# EAGLE design relais platine (EAGLE 6.1)
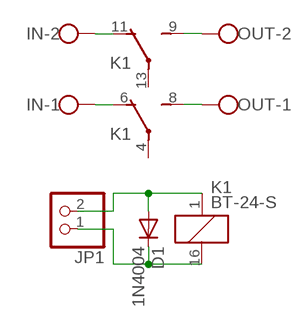
[diagram p0: schematic, sheet 1]

## Parts
D1  1N4004  [DO41-10]
IN  W237-102  [W237-102]
JP1  PINHD-1X2/90  [1X02/90]
K1  BT-24-S  [BT-XX-S]
OUT  W237-102  [W237-102]

## Nets
N$1: K1.8(-1:S) OUT.1
N$2: IN.2 K1.11(-2:O)
N$3: K1.9(-2:S) OUT.2
N$4: IN.1 K1.6(-1:O)
N$5: D1.A JP1.2 K1.1
N$6: D1.C JP1.1 K1.16
Unconnected: K1.4(-1:P) K1.13(-2:P)

## Library data of the parts
D1 = adafruit:1N4004: DIODE General purpose 1N400x type rectifier (With bigger pads) http://www.ladyada.net/library/pcb/eaglelibrary.html
IN OUT = con-wago-500:W237-102: WAGO SCREW CLAMP; MPN: 237-102; OC_FARNELL: unknown; OC_NEWARK: 70K9898
JP1 = pinhead:PINHD-1X2: PIN HEADER
K1 = relay:BT-*-S: KLEIN RELAIS WASCHDICHT 2 Wechsler Distriibutor: Conrad Electronic, Bestell Nr.: 505226-13 - 24V 505226-13 - 5V 505170-13 - 12V 505170-13 - 48V Bestar Electric Ltd. Source: http://www2.produktinfo.conrad.com/datenblaetter/500000-524999/505226-da-01-en-Kleinrelais_waschdicht_24V.pdf; OC_FARNELL: unknown; OC_NEWARK: unknown

## Board
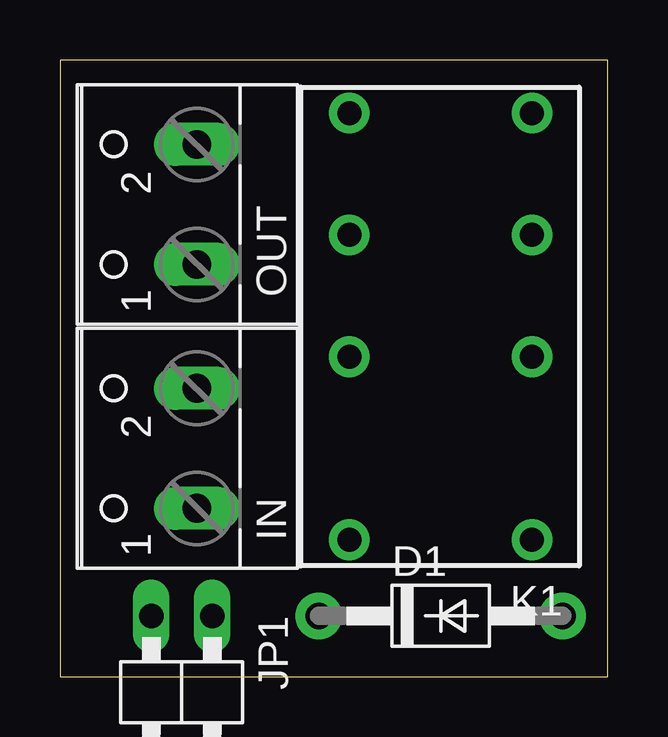
[diagram p1: board, top side]
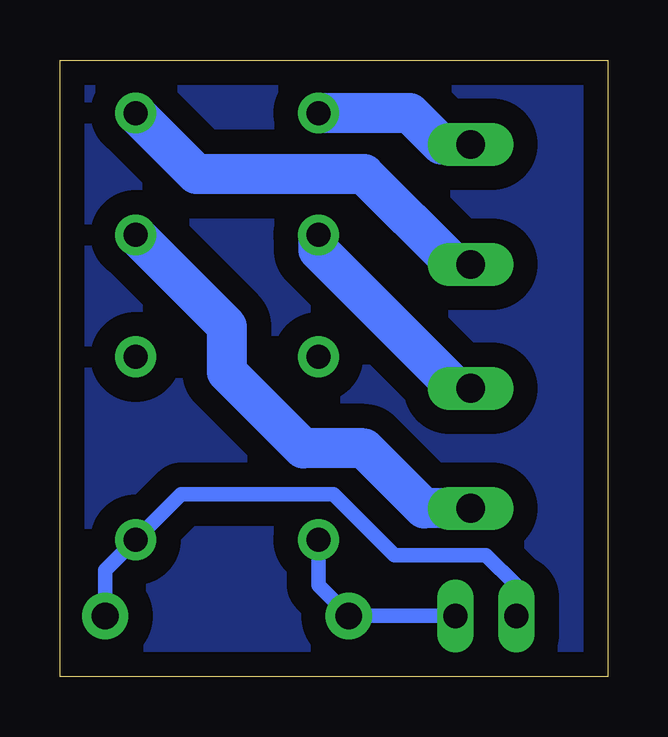
[diagram p2: board, bottom side, seen from below]

Size 22.84 x 25.7 mm. Coordinates in mm from the lower left corner, seen from the top.
Outline: 0,0 22.84,0 22.84,25.7 0,25.7 0,0
Copper layers (1*16): Top 0.035mm / dielectric 1.5mm / Bottom 0.035mm
Design rules: minimum track width 10mil, minimum drill 24mil, track to track 8mil, track to pad 8mil, pad to pad 8mil, via to via 8mil, smd to smd 8mil, copper to edge 40mil, drill to drill 8mil, minimum pad ring 10mil, minimum via ring 8mil, stop-mask expansion 4mil, vias tented up to drill 0mil, thermal gap 10mil

### Footprints (pad centres in the part's own frame; a part is rotated, then mirrored left to right if it is on the bottom)
DO41-10 = drill 1.118 pad 1.93: A 5.08,0; C -5.08,0
W237-102 = drill 1.194 long: 1 -2.5,-1.27; 2 2.5,-1.27
1X02/90 = drill 1.016 long: 1 -1.27,-3.81; 2 1.27,-3.81
BT-XX-S = drill 1 pad 1.7: 1 -8.89,-3.81; 4 -1.27,-3.81; 6 3.81,-3.81; 8 8.89,-3.81; 9 8.89,3.81; 11 3.81,3.81; 13 -1.27,3.81; 16 -8.89,3.81

### Placement (x,y rotation side)
D1  15.88,2.54 0 top
IN  4.45,9.53 90 top
JP1  5.08,-1.27 180 top
K1  15.88,14.61 90 top
OUT  4.45,19.68 90 top

### Tracks (layer width: path | path; a pad name or v marks a point on that pad's centre or on a via)
GND
  pour Bottom (isolate 1.016): 0,25.4 22.86,25.4 22.86,0 0,0
N$1
  Bottom 1.676: OUT.1 6.39,17.18 10.16,20.95 17.14,20.95 K1.8
N$2
  Bottom 1.676: IN.2 6.31,12.03 12.06,17.78 K1.11
N$3
  Bottom 1.676: OUT.2 6.95,22.18 8.26,23.5 K1.9
N$4
  Bottom 1.676: IN.1 7.66,7.03 10.16,9.53 12.7,9.53 15.88,12.7 15.88,14.61 K1.6
N$5
  Bottom 0.61: JP1.2 3.81,3.81 5.08,5.08 8.89,5.08 11.43,7.62 17.78,7.62 K1.1 20.95,4.45 D1.A
N$6
  Bottom 0.61: JP1.1 D1.C 12.06,3.81 K1.16